# EAGLE design adapter (EAGLE 6.6.0)
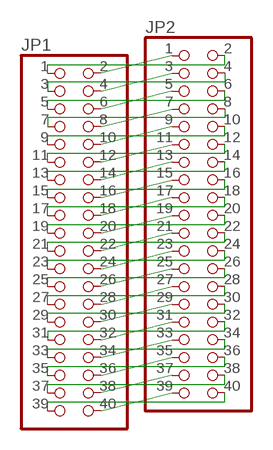
[diagram p0: schematic, sheet 1]

## Parts
JP1  PINHD-2X20  [2X20]
JP2  PINHD-2X20  [2X20]

## Nets
N$1: JP1.2 JP2.1
N$2: JP1.4 JP2.3
N$3: JP1.6 JP2.5
N$4: JP1.8 JP2.7
N$5: JP1.10 JP2.9
N$6: JP1.12 JP2.11
N$7: JP1.14 JP2.13
N$8: JP1.16 JP2.15
N$9: JP1.18 JP2.17
N$10: JP1.20 JP2.19
N$11: JP1.22 JP2.21
N$12: JP1.24 JP2.23
N$13: JP1.26 JP2.25
N$14: JP1.28 JP2.27
N$15: JP1.30 JP2.29
N$16: JP1.32 JP2.31
N$17: JP1.34 JP2.33
N$18: JP1.36 JP2.35
N$19: JP1.38 JP2.37
N$20: JP1.40 JP2.39
N$21: JP1.1 JP2.2
N$22: JP1.3 JP2.4
N$23: JP1.5 JP2.6
N$24: JP1.7 JP2.8
N$25: JP1.9 JP2.10
N$26: JP1.11 JP2.12
N$27: JP1.13 JP2.14
N$28: JP1.15 JP2.16
N$29: JP1.17 JP2.18
N$30: JP1.19 JP2.20
N$31: JP1.21 JP2.22
N$32: JP1.23 JP2.24
N$33: JP1.25 JP2.26
N$34: JP1.27 JP2.28
N$35: JP1.29 JP2.30
N$36: JP1.31 JP2.32
N$37: JP1.33 JP2.34
N$38: JP1.35 JP2.36
N$39: JP1.37 JP2.38
N$40: JP1.39 JP2.40

## Library data of the parts
JP1 JP2 = pinhead:PINHD-2X20: PIN HEADER

## Board
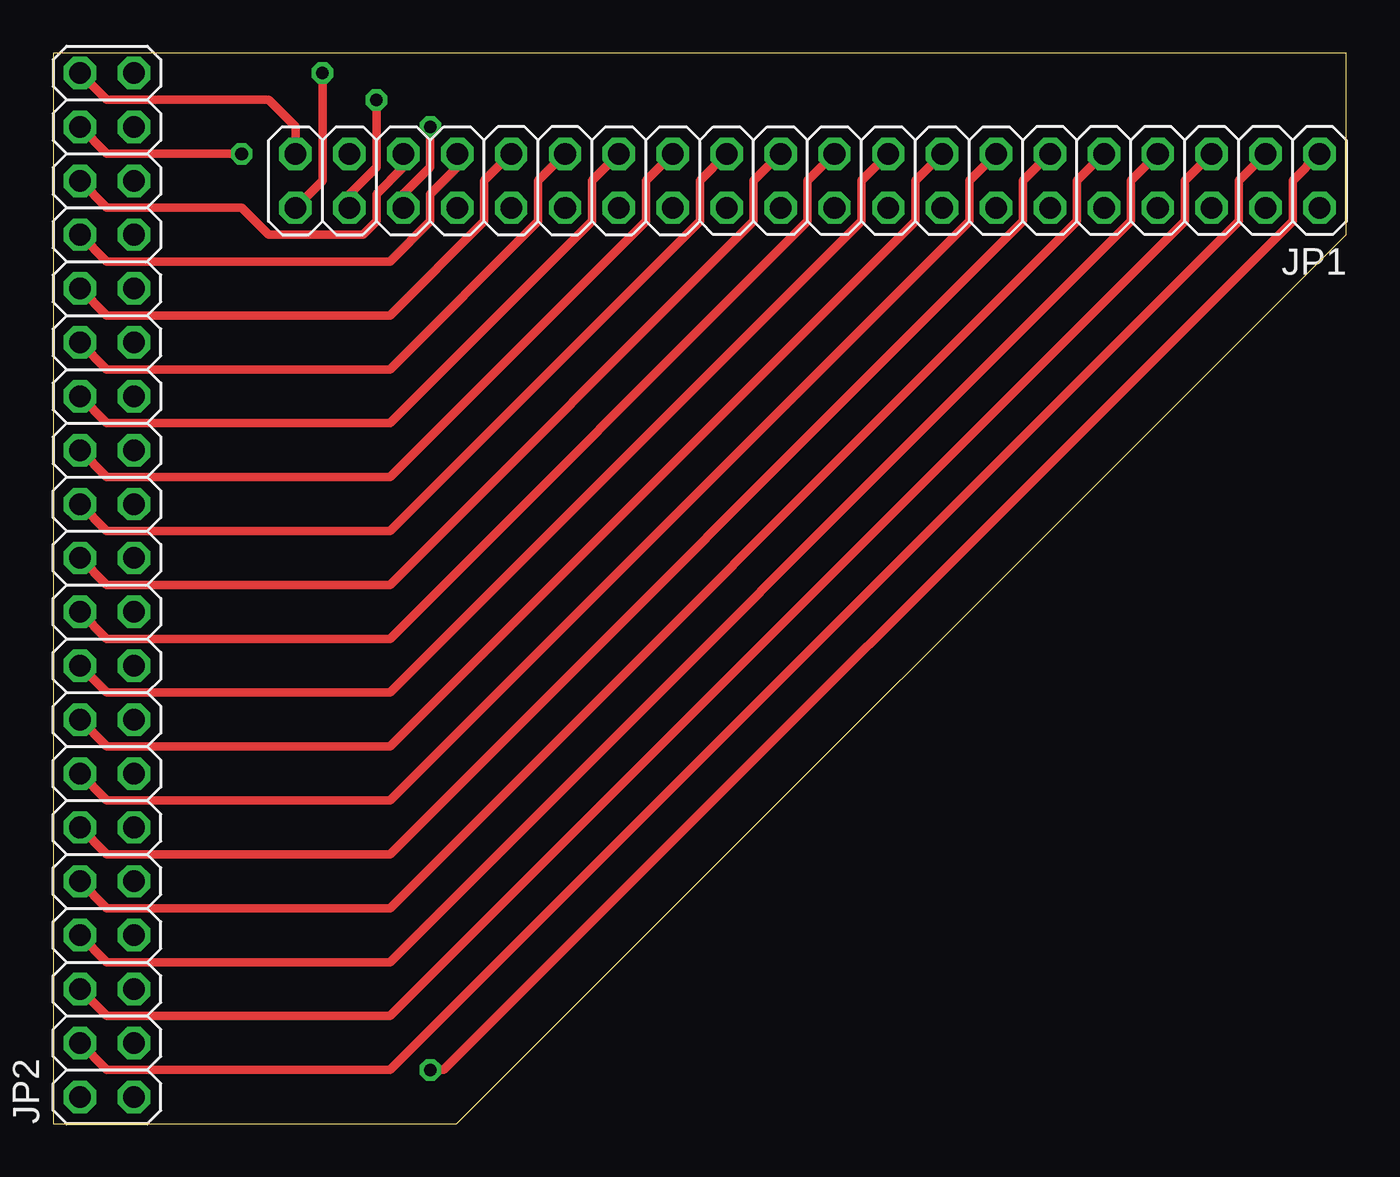
[diagram p1: board, top side]
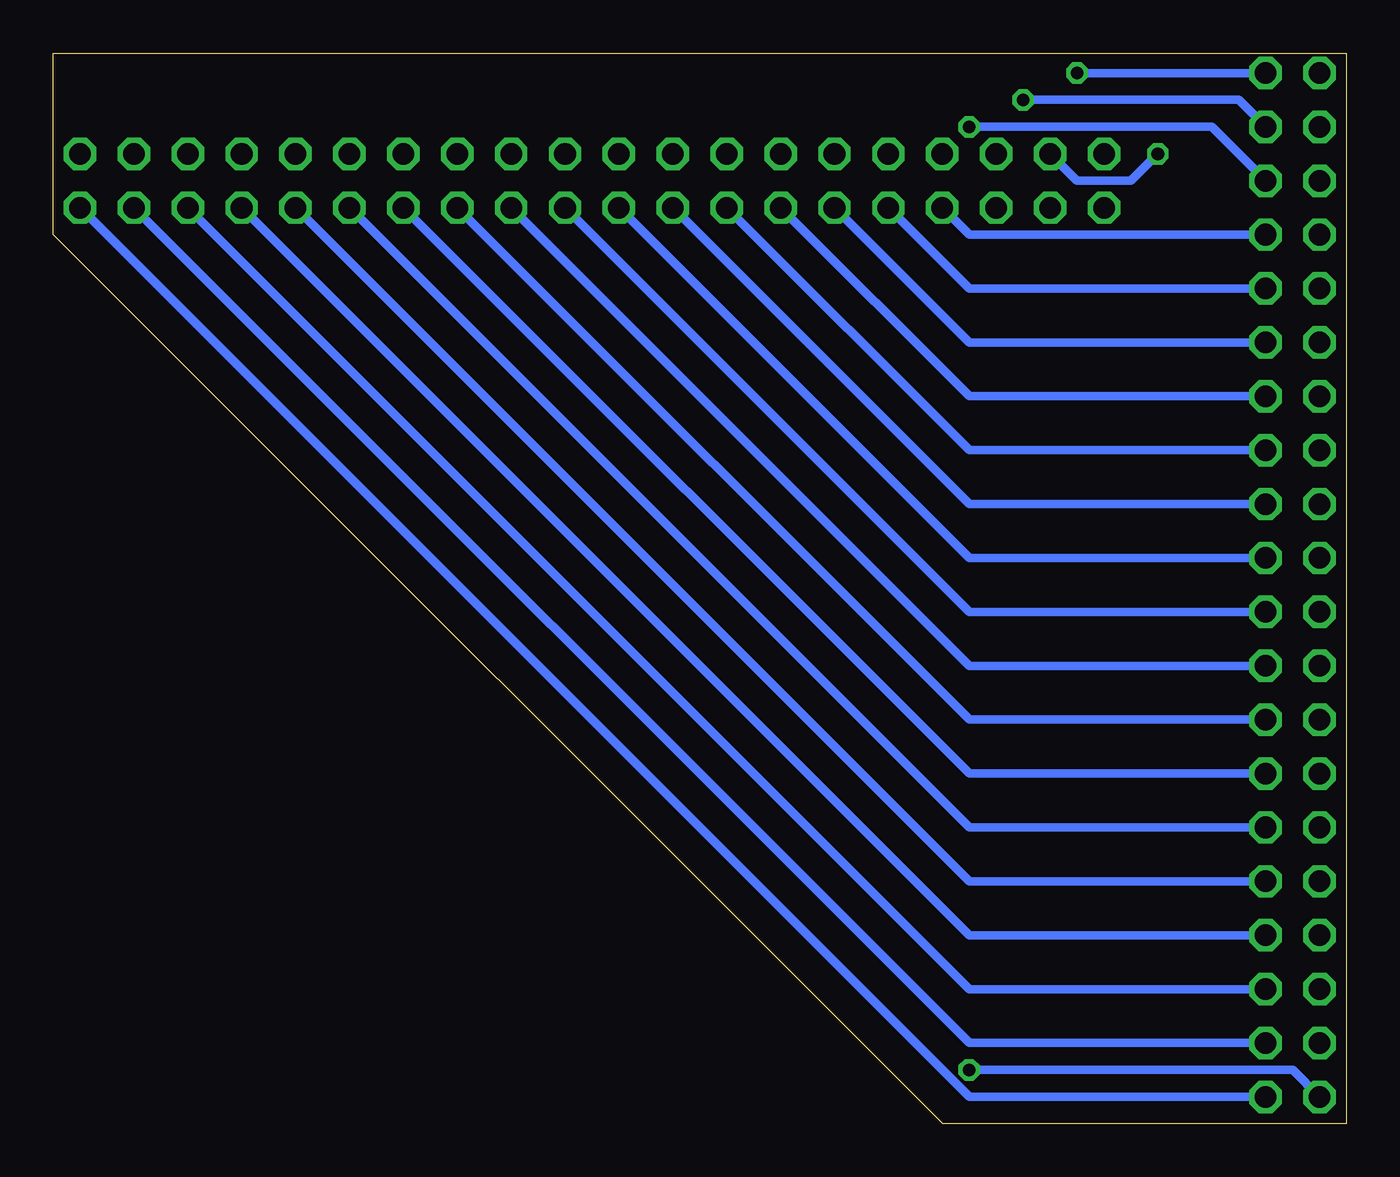
[diagram p2: board, bottom side, seen from below]

Size 60.96 x 50.47 mm. Coordinates in mm from the lower left corner, seen from the top.
Outline: 0,0 19.03,0 60.96,41.91 60.96,50.47 60.94,50.47 0,50.47 0,0
Copper layers (1*16): Top 0.035mm / dielectric 1.5mm / Bottom 0.035mm
Design rules "default": minimum track width 10mil, minimum drill 24mil, track to track 8mil, track to pad 8mil, pad to pad 8mil, via to via 8mil, smd to smd 8mil, copper to edge 40mil, drill to drill 8mil, minimum pad ring 10mil, minimum via ring 8mil, stop-mask expansion 4mil, vias tented up to drill 0mil, thermal gap 10mil

### Footprints (pad centres in the part's own frame; a part is rotated, then mirrored left to right if it is on the bottom)
2X20 = drill 1.016 octagon: 1 -24.13,-1.27; 2 -24.13,1.27; 3 -21.59,-1.27; 4 -21.59,1.27; 5 -19.05,-1.27; 6 -19.05,1.27; 7 -16.51,-1.27; 8 -16.51,1.27; 9 -13.97,-1.27; 10 -13.97,1.27; 11 -11.43,-1.27; 12 -11.43,1.27; 13 -8.89,-1.27; 14 -8.89,1.27; 15 -6.35,-1.27; 16 -6.35,1.27; 17 -3.81,-1.27; 18 -3.81,1.27; 19 -1.27,-1.27; 20 -1.27,1.27; 21 1.27,-1.27; 22 1.27,1.27; 23 3.81,-1.27; 24 3.81,1.27; 25 6.35,-1.27; 26 6.35,1.27; 27 8.89,-1.27; 28 8.89,1.27; 29 11.43,-1.27; 30 11.43,1.27; 31 13.97,-1.27; 32 13.97,1.27; 33 16.51,-1.27; 34 16.51,1.27; 35 19.05,-1.27; 36 19.05,1.27; 37 21.59,-1.27; 38 21.59,1.27; 39 24.13,-1.27; 40 24.13,1.27

### Placement (x,y rotation side)
JP1  35.56,44.45 180 top
JP2  2.54,25.4 90 top

### Tracks (layer width: path | path; a pad name or v marks a point on that pad's centre or on a via)
N$1
  Bottom 0.406: JP2.1 17.78,1.27 JP1.2
N$2
  Bottom 0.406: JP2.3 17.78,3.81 JP1.4
N$3
  Bottom 0.406: JP2.5 17.78,6.35 JP1.6
N$4
  Bottom 0.406: JP2.7 17.78,8.89 JP1.8
N$5
  Bottom 0.406: JP2.9 17.78,11.43 JP1.10
N$6
  Bottom 0.406: JP2.11 17.78,13.97 JP1.12
N$7
  Bottom 0.406: JP2.13 17.78,16.51 JP1.14
N$8
  Bottom 0.406: JP2.15 17.78,19.05 JP1.16
N$9
  Bottom 0.406: JP2.17 17.78,21.59 JP1.18
N$10
  Bottom 0.406: JP2.19 17.78,24.13 JP1.20
N$11
  Bottom 0.406: JP2.21 17.78,26.67 JP1.22
N$12
  Bottom 0.406: JP2.23 17.78,29.21 JP1.24
N$13
  Bottom 0.406: JP2.25 17.78,31.75 JP1.26
N$14
  Bottom 0.406: JP2.27 17.78,34.29 JP1.28
N$15
  Bottom 0.406: JP2.29 17.78,36.83 JP1.30
N$16
  Bottom 0.406: JP2.31 17.78,39.37 JP1.32
N$17
  Bottom 0.406: JP2.33 17.78,41.91 JP1.34
N$18  (via drill 0.6)
  Top 0.406: JP1.36 16.51,43.81 17.78,45.09 v17.78,46.99
  Bottom 0.406: JP2.35 6.35,46.99 v17.78,46.99
N$19  (via drill 0.6)
  Top 0.406: JP1.38 13.97,43.81 15.24,45.09 v15.24,48.26
  Bottom 0.406: JP2.37 5.08,48.26 v15.24,48.26
N$20  (via drill 0.6)
  Top 0.406: v12.7,49.53 12.7,44.45 JP1.40
  Bottom 0.406: JP2.39 v12.7,49.53
N$21  (via drill 0.6)
  Top 0.406: JP1.1 58.42,44.45 58.42,42.55 18.41,2.54 v17.78,2.54
  Bottom 0.406: JP2.2 2.54,2.54 v17.78,2.54
N$22
  Top 0.406: JP2.4 2.54,2.54 15.88,2.54 55.88,42.55 55.88,44.45 JP1.3
N$23
  Top 0.406: JP2.6 2.54,5.08 15.88,5.08 53.34,42.55 53.34,44.45 JP1.5
N$24
  Top 0.406: JP2.8 2.54,7.62 15.88,7.62 50.8,42.55 50.8,44.45 JP1.7
N$25
  Top 0.406: JP2.10 2.54,10.16 15.88,10.16 48.26,42.55 48.26,44.45 JP1.9
N$26
  Top 0.406: JP2.12 2.54,12.7 15.88,12.7 45.72,42.55 45.72,44.45 JP1.11
N$27
  Top 0.406: JP2.14 2.54,15.24 15.88,15.24 43.18,42.55 43.18,44.45 JP1.13
N$28
  Top 0.406: JP2.16 2.54,17.78 15.88,17.78 40.64,42.55 40.64,44.45 JP1.15
N$29
  Top 0.406: JP2.18 2.54,20.32 15.88,20.32 38.1,42.55 38.1,44.45 JP1.17
N$30
  Top 0.406: JP2.20 2.54,22.86 15.88,22.86 35.56,42.55 35.56,44.45 JP1.19
N$31
  Top 0.406: JP2.22 2.54,25.4 15.88,25.4 33.02,42.55 33.02,44.45 JP1.21
N$32
  Top 0.406: JP2.24 2.54,27.94 15.88,27.94 30.48,42.55 30.48,44.45 JP1.23
N$33
  Top 0.406: JP2.26 2.54,30.48 15.88,30.48 27.94,42.55 27.94,44.45 JP1.25
N$34
  Top 0.406: JP2.28 2.54,33.02 15.88,33.02 25.4,42.55 25.4,44.45 JP1.27
N$35
  Top 0.406: JP2.30 2.54,35.56 15.88,35.56 22.86,42.55 22.86,44.45 JP1.29
N$36
  Top 0.406: JP2.32 2.54,38.1 15.88,38.1 20.32,42.55 20.32,44.45 JP1.31
N$37
  Top 0.406: JP2.34 2.54,40.64 15.88,40.64 17.78,42.55 17.78,43.81 19.05,45.09 JP1.33
N$38
  Top 0.406: JP2.36 2.54,43.18 8.89,43.18 10.16,41.91 14.61,41.91 15.24,42.55 15.24,43.81 16.51,45.09 JP1.35
N$39  (via drill 0.6)
  Top 0.406: JP2.38 2.54,45.72 v8.89,45.72
  Bottom 0.406: v8.89,45.72 10.16,44.45 12.7,44.45 JP1.37
N$40
  Top 0.406: JP2.40 2.54,48.26 10.16,48.26 11.43,46.99 JP1.39